# EasyEDA Pro project ProProject_STM32G030F6P6开发板V1.1_2023-09-02.epro

# Schematic ScV1.1
Create Date: 2023-07-08; Page Name: P1; Project Name: STM32G030F6P6开发板V1.1; Schematic Name: ScV1.1; Update Date: 2023-07-08; Company: 嘉立创EDA; Page Size: A5; Version: V1.0
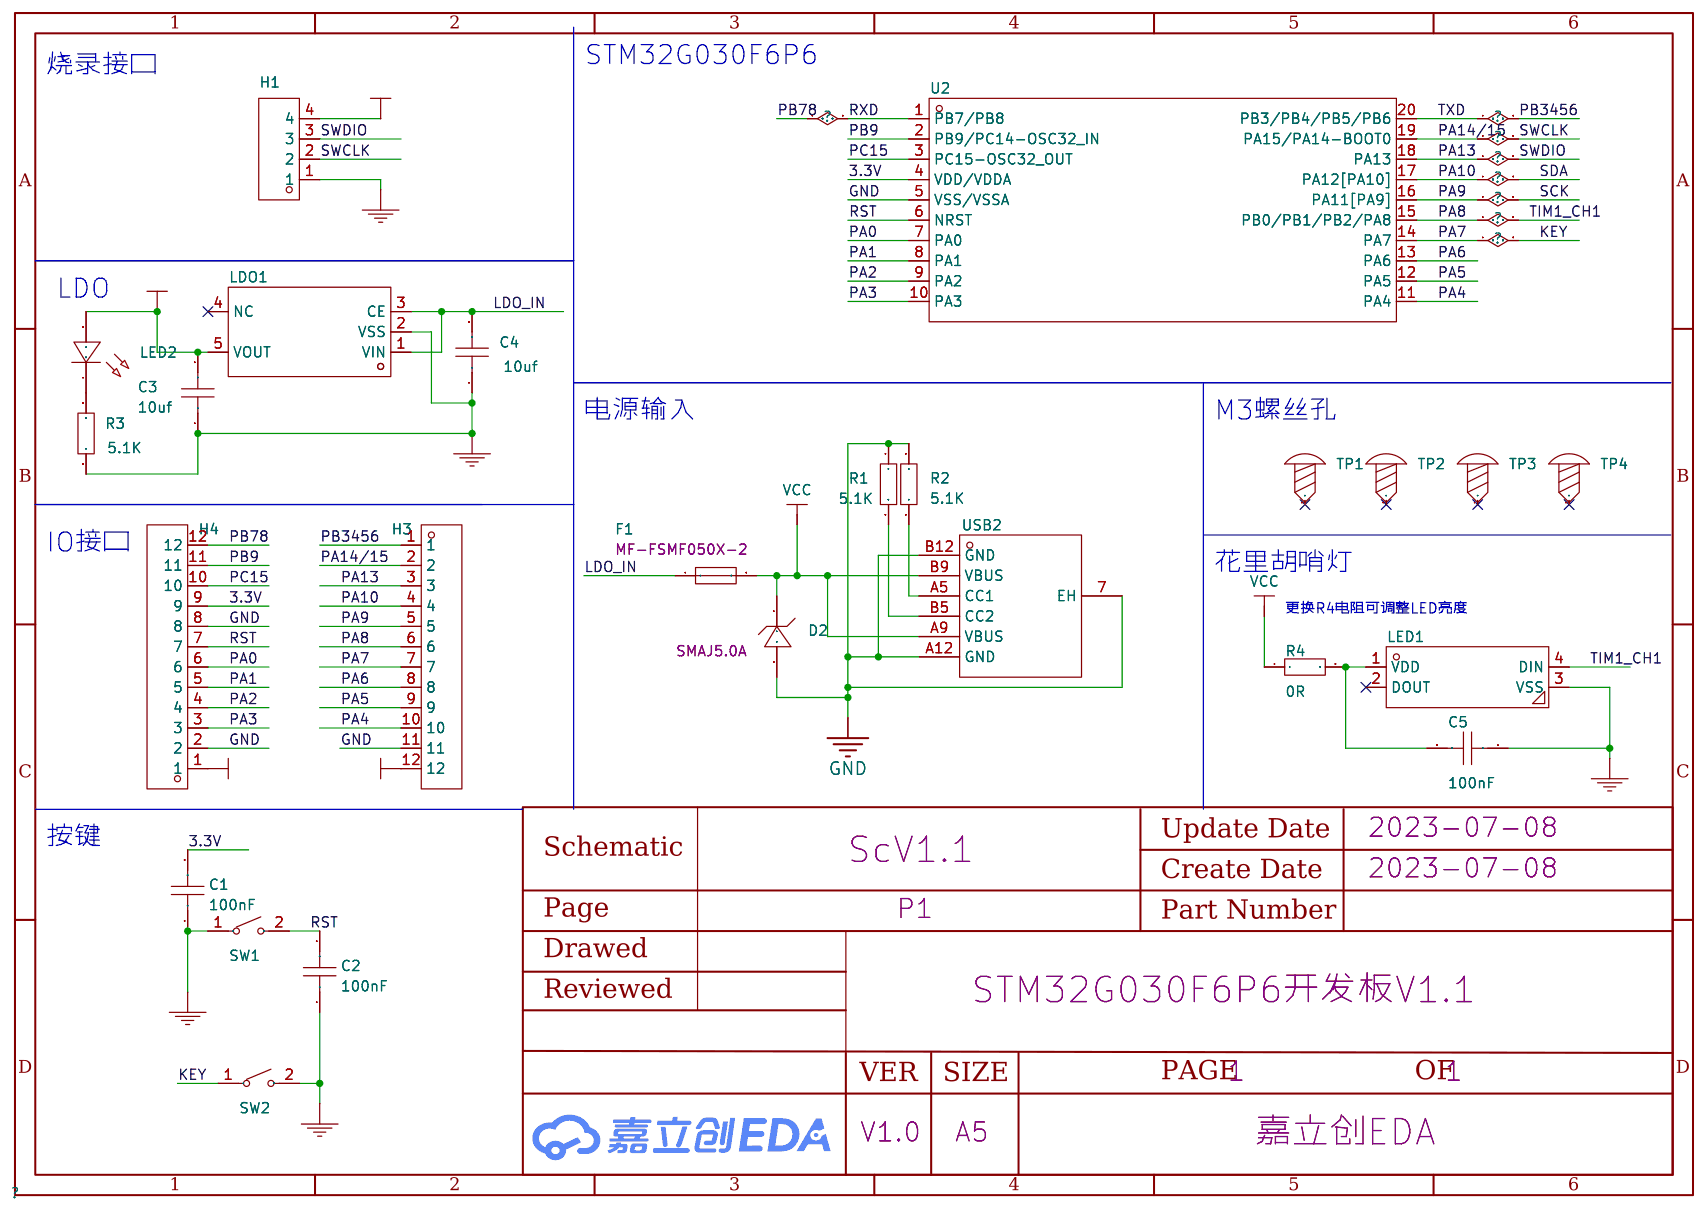
[diagram p0: schematic sheet]

## Parts
C1  100nF  [C0603]
C2  100nF  [C0603]
C3  10uf  [C0603]
C4  10uf  [C0603]
C5  100nF  [C0603]
D2  SMAJ5.0A  [SMA_L4.4-W2.6-LS5.0-RD]
F1  MF-FSMF050X-2  [F0603]
H1  -  [HDR-TH_4P-P2.54-V-F]
H3  -  [HDR-TH_12P-P2.54-V-M]
H4  -  [HDR-TH_12P-P2.54-V-M]
LDO1  -  [SOT-23-5_L3.0-W1.7-P0.95-LS2.8-BR]
LED1  WS2812B-B/W  [LED-SMD_4P-L5.0-W5.0-BL_TC5050RGB]
LED2  -  [LED_0603]
R1  5.1K  [R0603]
R2  5.1K  [R0603]
R3  5.1K  [R0603]
R4  0R  [R0603]
SW1  TS-1088R-02026  [SW-SMD_L3.9-W3.0-P4.45]
SW2  TS-1088R-02026  [SW-SMD_L3.9-W3.0-P4.45]
TP1  -  [M3螺丝]
TP2  -  [M3螺丝]
TP3  -  [M3螺丝]
TP4  -  [M3螺丝]
U2  -  [TSSOP-20_L6.5-W4.4-P0.65-LS6.4-BL]
USB2  -  [TYPE-C-SMD_TYPE-C-6P]

## Library data of the parts
C1-C5 = CAP_0603: Supplier Footprint: 0603
D2 = SMAJ5.0A_C113952: 极性:单向;反向截止电压(Vrwm):5V;击穿电压:6.4V;反向漏电流(Ir):800uA;峰值脉冲电流(Ipp)@10/1000s:43.5A;最大钳位电压:9.2V;; LCSC Part Name: 单向 Vrwm:5V; Supplier Part: C113952; Manufacturer: MDD; Supplier Footprint: SMA(DO-214AC); JLCPCB Part Class: Extended Part; Datasheet: https://atta.szlcsc.com/upload/public/pdf/source/20230314/4319D8044EE29783A53F6AC60595AA71.pdf; Supplier: LCSC; Polarity: 单向; Reverse Stand-Off Voltage (Vrwm): 5V; Breakdown Voltage: 6.4V; Reverse Leakage Current (Ir): 800uA; Peak Pulse Current (Ipp)@10/1000μs: 43.5A; Maximum Clamping Voltage: 9.2V
F1 = MF-FSMF050X-2: 最大电压:6V;最大电流:40A;保持电流:500mA;跳闸电流:1A;初始态阻值(最小值):800mΩ;跳断后阻值(最大值):100mΩ;最大动作时间:100ms;工作温度:-40℃~+85℃;; LCSC Part Name: 6V 500mA; Supplier Part: C210357; Manufacturer: BOURNS; Supplier Footprint: 0603; JLCPCB Part Class: Extended Part; Datasheet: https://atta.szlcsc.com/upload/public/pdf/source/20180524/C210357_26D2BEEFC098B5962B9D8AEB60E1F9FC.pdf; Supplier: LCSC; Operating Voltage (Max): 6V; Current Rating (Max): 40A; Hold Current: 500mA; Trip Current: 1A; Resistance - Initial (Ri) (Min): 800mΩ; Resistance - Post Trip (R1) (Max): 100mΩ; Maximum Time to Trip: 100ms; Operating Temperature: -40℃~+85℃
H1 = HDR-F_2.54_1x4P: Supplier Part: C2718488; Supplier Footprint: 插件
H3 H4 = HDR-M_2.54_1x12P: 间距:2.54mm;总PIN位数:12;排数:1;插针结构:1x12P;行距:-;安装类型:直插;圆针/方针:方针;额定电流:3A;额定电压:250V;配合针长度:6mm;塑高:2.5mm;端接针长度:3mm;触头材质:-;工作温度范围:-40℃~+105℃;颜色:黑色;; Supplier Part: C2840012; Supplier Footprint: 插件
LDO1 = ME6211C33M5G-N: 输出类型:固定;输出极性:正;输出通道数:1;最大输入电压:6V;输出电压:3.3V;压差:260mV@(200mA);输出电流:500mA;电源纹波抑制比(PRSS):70dB@(1kHz),62dB@(10kHz);; LCSC Part Name: Vin=6V Vout=3.3V 500mA 70dB@(1kHz),62dB@(10kHz); Supplier Part: C82942; Manufacturer: MICRONE(南京微盟); Supplier Footprint: SOT-23-5; JLCPCB Part Class: Extended Part; Datasheet: https://atta.szlcsc.com/upload/public/pdf/source/20170918/C82942_1505727073070976520.pdf; Supplier: LCSC; Output Type: 固定; Output Polarity: 正; Number of Outputs: 1; Maximum Input Voltage: 6V; Output Voltage: 3.3V; Dropout Voltage: 260mV@(200mA); Output Current: 500mA; Power Supply Rejection Ratio (PRSS): 70dB@(1kHz),62dB@(10kHz)
LED1 = WS2812B-B/W: 发光颜色:RGB三色;; LCSC Part Name: RGB三色 （注意防潮，请查阅规格书中对应具体内容）; Supplier Part: C114586; Manufacturer: worldsemi; Supplier Footprint: SMD5050; JLCPCB Part Class: Extended Part; Datasheet: https://atta.szlcsc.com/upload/public/pdf/source/20200615/C114586_26EB6813EC9F2A3F6C7FBB2AD75DE01F.pdf; Supplier: LCSC; Emitted Color: RGB三色
LED2 = LED_0603-G: Supplier Footprint: 0603
R1-R4 = Res_0603: Supplier Footprint: 0603
SW1 SW2 = TS-1088R-02026: 触点电流:50mA;额定电压(DC):12V;电路结构:单刀单掷;安装方式:立贴;带灯:-;机械寿命:-;; LCSC Part Name: 3.9*2.93*2mm 立贴 轻触开关; Supplier Part: C455280; Manufacturer: XUNPU(讯普); Supplier Footprint: SMD,3x4mm; JLCPCB Part Class: Extended Part; Datasheet: https://atta.szlcsc.com/upload/public/pdf/source/20191118/C455280_718CC4284DAF75EEB0AC8229AE7E40C5.pdf; Supplier: LCSC; Contact Current: 50mA; Voltage Rating (DC): 12V; Circuit: 单刀单掷; Mounting Style: 立贴; Actuator Style: 圆形按钮; Switch Length: 3.9mm; Switch Width: 2.93mm; Switch Height: 2mm
TP1-TP4 = M3螺丝: Supplier Footprint: 插件
U2 = STM32G030F6P6: CPU位数:-;ROM类型:-;CPU内核:-;主频（MAX):-;工作电压:-;; Supplier Part: C724040; Manufacturer: ST(意法半导体); Supplier Footprint: TSSOP-20; JLCPCB Part Class: Extended Part; Datasheet: https://atta.szlcsc.com/upload/public/pdf/source/20200511/C529329_A1CB615556C746C4EA827FCAD1461480.pdf; Supplier: LCSC
USB2 = TYPE-C 6P: 连接器类型:Type-C;标准:-;公母:母座;触点数量:6;端口数量:1;安装方式:卧贴;额定电流 - 电源:-;工作温度范围:-40~+85;; LCSC Part Name: Type-C 母头 6pin简易款四脚端子SMT+DIP 停产; Supplier Part: C456012; Manufacturer: SHOU HAN(首韩); Supplier Footprint: SMD; JLCPCB Part Class: Extended Part; Datasheet: https://atta.szlcsc.com/upload/public/pdf/source/20201203/C456012_B13F72044DF846EDBE9BDD0D1D3CD166.pdf; Supplier: LCSC; Connector Type: Type-C; Gender: 母座; Number of Contacts: 6; Number of Ports: 1; Mounting Style: 卧贴; Operating Temperature Range: -40~+85

## Nets
3.3V: C1.2 C3.2 H1.4 H4.9 LDO1.5(VOUT) LED2.2(A) U2.4(VDD/VDDA)
GND: C1.1 C2.1 C3.1 C4.1 C5.1 D2.2 H1.1 H3.11 H4.2 H4.8 LDO1.2(VSS) LED1.3(VSS) R1.1 R2.1 R3.1 SW1.1 SW2.2 U2.5(VSS/VSSA) USB2.7(EH) USB2.A12(GND) USB2.B12(GND)
VCC: D2.1 F1.2 H3.12 H4.1 R4.1 USB2.A9(VBUS) USB2.B9(VBUS)
KEY: H3.7 SW2.1 U2.14(PA7)
LDO_IN: C4.2 F1.1 LDO1.1(VIN) LDO1.3(CE)
PA0: H4.6 U2.7(PA0)
PA1: H4.5 U2.8(PA1)
PA2: H4.4 U2.9(PA2)
PA3: H4.3 U2.10(PA3)
PA4: H3.10 U2.11(PA4)
PA5: H3.9 U2.12(PA5)
PA6: H3.8 U2.13(PA6)
PA8: H3.6 LED1.4(DIN) U2.15(PB0/PB1/PB2/PA8)
PA9: H3.5 U2.16(PA11[PA9])
PA10: H3.4 U2.17(PA12[PA10])
PA13: H1.3 H3.3 U2.18(PA13)
PA14/15: H1.2 H3.2 U2.19(PA15/PA14-BOOT0)
PB9: H4.11 U2.2(PB9/PC14-OSC32_IN)
PB78: H4.12 U2.1(PB7/PB8)
PB3456: H3.1 U2.20(PB3/PB4/PB5/PB6)
PC15: H4.10 U2.3(PC15-OSC32_OUT)
RST: C2.2 H4.7 SW1.2 U2.6(NRST)
$1N33946: R2.2 USB2.A5(CC1)
$1N33995: R1.2 USB2.B5(CC2)
$1N39689: LED2.1(C) R3.2
$1N41704: C5.2 LED1.1(VDD) R4.2

Not connected (* = marked no-connect by the designer): LDO1 4(NC)*; LED1 2(DOUT)*; TP1 1*; TP2 1*; TP3 1*; TP4 1*

## Notes on the sheet
- 烧录接口
- STM32G030F6P6
- LDO
- 电源输入
- M3螺丝孔
- IO接口
- 花里胡哨灯
- 更换R4电阻可调整LED亮度
- 按键

# Board PCBV1.1
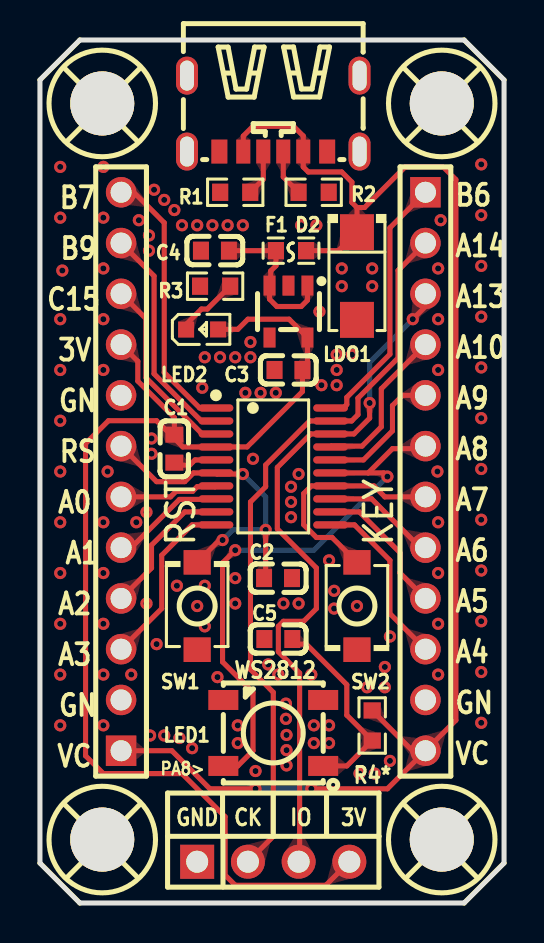
[diagram p1: board, top side]
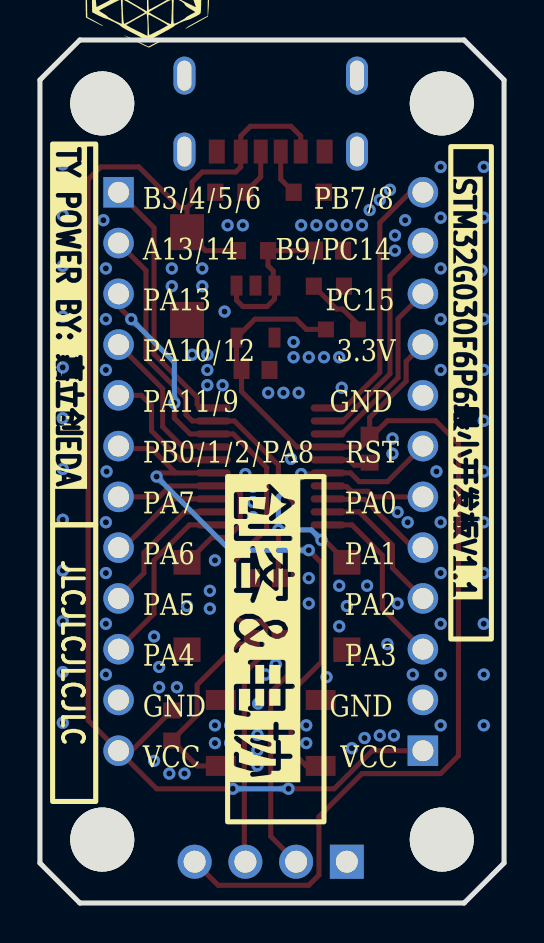
[diagram p2: board, bottom side, seen from below]

Outline 23.24 x 43.18 mm; copper layers: Top Layer, Bottom Layer. Coordinates in mm from the lower left corner of the outline.
Outline path: 0,41.18 0,2 2,0 21.24,0 23.24,2 23.24,41.18 21.24,43.18 2,43.18 0,41.18
Stack: Top Layer 0.035mm / Dielectric1 1.51mm FR4 er 4.5 / Bottom Layer 0.035mm

## Design rules (mm)
spacing safeClearance (default): track to track 0.152, other pairs 0.152 to 0.3
spacing IO_Clearance: track to track 0.08, other pairs 0.152 to 0.3
track width trackWidth (default): min 0.127, default 0.254, max 2.54
differential pair differentialPair (default): width min 0.127, default 0.254, max 2.54; gap min 0.152, default 0.152
via viaSize (default): diameter min 0.25, default 0.3, max 5; hole min 0.15, default 0.15, max 3

## Placement (name value [footprint] x y rotation side)
C1  100nF  [C0603]  6.73 22.73 90 top
C2  100nF  [C0603]  11.92 16.26 180 top
C3  10uf  [C0603]  12.45 26.67 0 top
C4  10uf  [C0603]  8.76 32.64 0 top
C5  100nF  [C0603]  11.94 13.21 0 top
D2  SMAJ5.0A  [SMA_L4.4-W2.6-LS5.0-RD]  15.88 31.37 270 top
F1  MF-FSMF050X-2  [F0603]  12.57 32.64 0 top
H1  2.54-1*4P母  [HDR-TH_4P-P2.54-V-F]  11.68 2.07 0 top
H3  KH-2PH180-1X12P-L8.7  [HDR-TH_12P-P2.54-V-M]  19.3 21.59 270 top
H4  KH-2PH180-1X12P-L8.7  [HDR-TH_12P-P2.54-V-M]  4.06 21.59 90 top
LDO1  ME6211C33M5G-N  [SOT-23-5_L3.0-W1.7-P0.95-LS2.8-BR]  12.45 29.59 90 top
LED1  WS2812B-B/W  [LED-SMD_4P-L5.0-W5.0-BL_TC5050RGB]  11.68 8.51 180 top
LED2  -  [LED_0603]  8.17 28.7 0 top
R1  5.1K  [R0603]  9.78 35.56 0 top
R2  5.1K  [R0603]  13.71 35.56 180 top
R3  5.1K  [R0603]  8.77 30.86 0 top
R4  0R  [R0603]  16.64 8.88 270 top
SW1  TS-1088R-02026  [SW-SMD_L3.9-W3.0-P4.45]  7.87 14.86 90 top
SW2  TS-1088R-02026  [SW-SMD_L3.9-W3.0-P4.45]  15.88 14.86 270 top
TP1  -  [M3螺丝]  3.18 3.11 0 top
TP2  -  [M3螺丝]  20.18 3.11 0 top
TP3  -  [M3螺丝]  3.18 39.94 0 top
TP4  -  [M3螺丝]  20.18 39.94 0 top
U2  -  [TSSOP-20_L6.5-W4.4-P0.65-LS6.4-BL]  11.68 21.84 270 top
USB2  -  [TYPE-C-SMD_TYPE-C-6P]  11.68 39.5 180 top

## Footprints (pads in the part's own frame, mm; a bottom-side part is the same pattern mirrored in y, then rotated)
C0603
  rect 0.8x0.9 smd: 1(-0.7,0) 2(0.7,0)
F0603
  rect 0.806x0.864 smd: 1(-0.753,0) 2(0.753,0)
HDR-TH_4P-P2.54-V-F
  rect 1.7x1.7 hole 1.1: 1(-3.81,0)
  round 1.7 hole 1.1: 2(-1.27,0) 3(1.27,0) 4(3.81,0)
HDR-TH_12P-P2.54-V-M
  rect 1.524x1.524 hole 1.05: 1(-13.97,0)
  round 1.524 hole 1.05: 2(-11.43,0) 3(-8.89,0) 4(-6.35,0) 5(-3.81,0) 6(-1.27,0) 7(1.27,0) 8(3.81,0) 9(6.35,0) 10(8.89,0) 11(11.43,0) 12(13.97,0)
LED-SMD_4P-L5.0-W5.0-BL_TC5050RGB
  rect 1.5x1 smd: 1(-2.5,1.65) 2(-2.5,-1.65) 3(2.5,-1.65) 4(2.5,1.65)
LED_0603
  rect 0.8x0.8 smd: 1(-0.851,-0.01) 2(0.75,-0.005)
M3螺丝
  round 3.2 hole 3.2: 1(-0.064,0.064)
R0603
  rect 0.806x0.864 smd: 1(-0.753,0) 2(0.753,0)
SMA_L4.4-W2.6-LS5.0-RD
  rect 1.8x1.7 smd: 1(-2.192,0) 2(2.192,0)
SOT-23-5_L3.0-W1.7-P0.95-LS2.8-BR
  rect 1x0.6 smd: 1(1.3,-0.95) 2(1.3,0) 3(1.3,0.95) 4(-1.3,0.95) 5(-1.3,-0.95)
SW-SMD_L3.9-W3.0-P4.45
  rect 1.23x1.36 smd: 1(-2.185,0) 2(2.185,0)
TSSOP-20_L6.5-W4.4-P0.65-LS6.4-BL
  oval 0.364x1.742 smd: 1(-2.925,-2.871) 2(-2.275,-2.871) 3(-1.625,-2.871) 4(-0.975,-2.871) 5(-0.325,-2.871) 6(0.325,-2.871) 7(0.975,-2.871) 8(1.625,-2.871) 9(2.275,-2.871) 10(2.925,-2.871) 11(2.925,2.871) 12(2.275,2.871) 13(1.625,2.871) 14(0.975,2.871) 15(0.325,2.871) 16(-0.325,2.871) 17(-0.975,2.871) 18(-1.625,2.871) 19(-2.275,2.871) 20(-2.925,2.871)
TYPE-C-SMD_TYPE-C-6P
  oval 1.1x1.9 hole 0.701x1.501: 7(-4.321,1.9) 7(-4.321,-1.9) 7(4.321,1.9) 7(4.321,-1.9)
  rect 0.701x1.199 smd: A5(-0.5,1.9) A9(1.501,1.9) B5(0.5,1.9) B9(-1.501,1.9)
  rect 0.8x1.199 smd: A12(2.7,1.9) B12(-2.7,1.9)

## Nets
As in the schematic.

Pads without a net: LDO1 4; LED1 2; TP1 1; TP2 1; TP3 1; TP4 1

## Via types
v1: diameter 0.61, hole 0.305, Top Layer to Bottom Layer, 136 vias

## Routing (per net, layer and track width the routed paths; a pad name or vN(x,y) marks a point on that pad's centre or on a via; arc(x,y) is an arc through that point)
3.3V: length 60.1
  Top Layer w0.254: 6.48,23.5 5.84,24.13 3.43,24.13 2.29,22.99 2.29,7.37 3.18,6.48 7.11,6.48 9.27,4.32 9.27,1.4 9.78,0.89 14.32,0.89 H1.4 ; 6.48,23.5 7.15,22.82 U2.4 10.37,22.82 13.15,25.59 C3.2 13.4,26.92 13.4,28.29 12.48,29.21 10.41,29.21 9.91,28.7 9.27,28.7 ; 6.48,23.5 6.73,23.5 6.73,24.28 4.9,26.11 4.9,27.1 H4.9
GND: length 2.4
  Top Layer w0.254: U2.5 7.76,22.17 7.5,21.91 6.48,21.91
  vias: v1(1.02,36.83) v1(1.02,34.29) v1(1.02,29.21) v1(1.02,26.67) v1(1.02,24.13) v1(1.02,21.59) v1(1.02,19.05) v1(1.02,16.51) v1(1.02,13.97) v1(1.02,11.43) v1(1.02,8.89) v1(1.12,31.64) v1(3.18,36.83) v1(3.18,34.29) v1(3.18,31.75) v1(3.18,29.21) v1(3.18,26.67) v1(3.18,19.05) v1(3.18,16.51) v1(3.18,13.97) v1(3.18,11.43) v1(3.18,8.89) v1(3.39,21.59) v1(4.57,11.43) v1(4.83,19.05) v1(4.95,34.16) v1(5.33,19.56) v1(5.33,14.99) v1(5.46,33.4) v1(5.46,32.64) v1(5.52,8.38) v1(5.59,23.24) v1(5.59,22.48) v1(5.72,35.69) v1(5.84,12.95) v1(6.22,35.18) v1(6.22,8.38) v1(6.73,34.67) v1(6.86,15.88) v1(6.98,8.26) v1(7.11,33.91) v1(7.62,7.75) v1(7.87,33.91) v1(7.87,14.86) v1(8.13,25.78) v1(8.25,27.31) v1(8.25,15.88) v1(8.25,13.84) v1(8.64,33.91) v1(8.89,11.3) v1(9.02,27.31) v1(9.4,33.91) v1(9.78,27.31) v1(9.78,16.26) v1(9.78,14.99) v1(9.91,8.89) v1(9.91,8) v1(10.16,33.91) v1(10.29,25.53) v1(10.54,28.07) v1(10.54,27.31) v1(10.67,22.23) v1(10.79,6.6) v1(11.05,25.53) v1(11.43,11.94) v1(11.81,25.53) v1(11.94,11.43) v1(12.19,14.99) v1(12.32,9.98) v1(12.32,9.21) v1(12.35,8.41) v1(12.35,7.65) v1(12.35,6.89) v1(12.57,20.83) v1(12.57,20.07) v1(12.57,19.3) v1(12.95,21.46) v1(12.95,14.99) v1(13.08,33.91) v1(13.59,11.43) v1(13.72,8.89) v1(13.72,8) v1(13.84,33.91) v1(14,29.59) v1(14.1,25.91) v1(14.48,17.15) v1(14.48,8.89) v1(14.48,8) v1(14.73,15.62) v1(14.73,14.73) v1(14.86,27.43) v1(14.86,26.67) v1(14.86,25.91) v1(15.11,31.75) v1(15.11,30.86) v1(15.62,27.43) v1(15.88,14.86) v1(16,6.48) v1(16.38,10.8) v1(16.64,31.75) v1(16.64,30.86) v1(16.76,6.48) v1(17.27,11.81) v1(17.27,10.8) v1(17.53,13.34) v1(17.53,7.11) v1(19.9,21.59) v1(19.94,31.75) v1(19.94,29.21) v1(19.94,26.67) v1(19.94,19.05) v1(19.94,16.51) v1(19.94,13.97) v1(19.94,11.43) v1(20.07,34.16) v1(22.1,36.96) v1(22.1,34.42) v1(22.1,31.88) v1(22.1,29.34) v1(22.1,26.8) v1(22.1,24.26) v1(22.1,21.72) v1(22.1,19.18) v1(22.1,16.64) v1(22.1,14.1) v1(22.1,11.56) v1(22.1,9.02)
VCC: length 69.6
  Top Layer w0.254: H3.12 18.65,7.62 R4.1 ; H3.12 20.83,9.14 20.83,36.2 20.19,36.83 18.29,36.83 16.26,34.8 15.88,34.8 ; H3.12 17.4,5.72 v1(13.59,5.72) ; H4.1 6.6,7.62 8.51,5.72 v1(10.79,5.72) ; 15.88,34.8 15.62,35.05 15.62,36.07 15.11,36.58 13.44,36.58 13.19,36.83 13.19,38.38 12.7,38.86 10.67,38.86 10.18,38.37 10.18,37.6 ; 15.88,34.8 15.88,33.57 14.94,32.64 F1.2
  Bottom Layer w0.254: v1(13.59,5.72) v1(10.79,5.72)
KEY: length 11.5
  Top Layer w0.254: SW2.1 14.63,18.29 13.84,18.29 13.21,18.92 13.21,20.49 13.59,20.87 U2.14 16.72,20.87 17.27,20.32 H3.7
LDO_IN: length 7.8
  Top Layer w0.254: C4.2 F1.1 11.82,31.89 11.56,31.62 11.56,30.95 LDO1.3 11.5,30.21 11.86,29.84 13.08,29.84 13.4,30.16 LDO1.1
PA0: length 5
  Top Layer w0.254: U2.7 8.77,20.83 7.87,20.83 7.65,20.6 6.82,20.6 6.54,20.32 H4.6
PA1: length 5.8
  Top Layer w0.254: H4.5 4.57,17.78 6.98,20.19 8.79,20.19 U2.8
PA2: length 7.2
  Top Layer w0.254: H4.4 5.59,16.76 5.59,17.91 7.25,19.57 U2.9
PA3: length 8.9
  Top Layer w0.254: 8.81,18.92 7.62,18.92 6.1,17.4 6.1,14.73 H4.3
PA4: length 8.9
  Top Layer w0.254: 14.56,18.92 15.75,18.92 17.53,17.15 17.53,14.48 H3.10
PA5: length 7.1
  Top Layer w0.254: H3.9 18.03,16.51 18.03,17.53 15.99,19.57 U2.12
PA6: length 5.8
  Top Layer w0.254: U2.13 16.61,20.22 19.05,17.78 H3.8
PA8: length 28.2
  Top Layer w0.254: v1(9.78,17.65) 9.14,17.02 9.14,12.06 10.67,10.54 10.67,7.62 9.91,6.86 LED1.4 ; 16.44,21.52 17.22,21.52 v1(17.4,21.34) ; 16.44,21.52 U2.15 ; 16.44,21.52 17.65,22.73 19.18,22.73 H3.6
  Bottom Layer w0.254: v1(9.78,17.65) 13.72,17.65 v1(17.4,21.34)
PA9: length 6.8
  Top Layer w0.254: U2.16 16.2,22.17 17.65,23.62 17.65,24.89 18.16,25.4 H3.5
PA10: length 8
  Top Layer w0.254: U2.17 14.6,22.86 16.13,22.86 17.09,23.83 17.09,25.73 H3.4
PA13: length 35.4
  Top Layer w0.254: v1(18.67,29.21) 19.3,29.84 H3.3 ; H1.3 13,2.12 13,11.51 11.94,12.57 11.94,13.84 12.19,14.1 13.21,14.1 13.84,14.73 13.84,16.76 11.89,18.72 11.89,21.79 13.56,23.47 U2.18 15.72,23.47 16.51,24.26 v1(16.51,25.02)
  Bottom Layer w0.254: v1(16.51,25.02) 16.51,27.05 v1(18.67,29.21)
PA14/15: length 36.8
  Top Layer w0.254: H3.2 17.93,31.65 17.93,27.27 15.93,25.26 15.93,24.43 15.61,24.12 13.51,24.12 11.3,21.92 11.3,20.83 10.54,20.07 10.54,11.68 11.68,10.54 11.68,3.34 H1.2
PB9: length 11.3
  Top Layer w0.254: 8.81,24.12 8.07,24.12 5.72,26.48 5.72,31.37 H4.11
PB78: length 13.6
  Top Layer w0.254: H4.12 4.7,35.56 6.22,34.04 6.22,26.54 8,24.77 U2.1
PB3456: length 13.1
  Top Layer w0.254: H3.1 17.53,33.78 17.53,27.46 15.37,25.3 15.37,24.94 15.19,24.77 U2.20
PC15: length 9.4
  Top Layer w0.254: U2.3 8.12,23.47 5.31,26.28 5.31,29.24 H4.10
RST: length 16.8
  Top Layer w0.254: H4.7 5.84,21.08 7.25,21.08 7.69,21.52 U2.6 8.87,21.46 v1(10.16,21.46) ; v1(11.3,18.67) 11.3,16.32 11.37,16.26 ; SW1.2 8.99,18.16 v1(9.14,18.16)
  Bottom Layer w0.254: v1(9.14,18.16) 9.65,18.67 v1(11.3,18.67) 11.3,20.32 v1(10.16,21.46)
$1N33946: length 2.4
  Top Layer w0.254: 12.18,37.6 12.18,36.33 R2.2
$1N33995: length 2.3
  Top Layer w0.254: 11.18,37.6 11.18,36.21 R1.2
$1N39689: length 3.3
  Top Layer w0.254: R3.2 8.38,29.72 8.09,29.72 7.07,28.7
$1N41704: length 10
  Top Layer w0.254: C5.2 12.89,12.95 13.34,12.95 15.37,10.92 15.37,9.4 R4.2 15.37,6.86 LED1.1

## Copper pours and planes (outline as drawn; the poured copper is in the pictures)
GND on Top Layer: -8.64,44.07 28.96,44.07 28.96,-1.91 -8.64,-1.91
GND on Bottom Layer: -0.38,44.32 24.76,44.32 24.76,-2.41 -0.38,-2.41

Small or netless copper shapes (teardrops, artwork), in the pictures only: 92 on Top Layer, 10 on Bottom Layer

## Text on the board
Bottom Silkscreen Layer: JLCJLCJLCJLC | RST | PA0 | PA1 | PA2 | PA3 | VCC | 3.3V | GND | PC15 | PB7/8 | B9/PC14 | B3/4/5/6 | A13/14 | PA13 | PA10/12 | PA11/9 | PB0/1/2/PA8 | PA7 | PA6 | PA5 | PA4 | STM32G030F6P6最小开发板V1.1 | TY POWER BY: 嘉立创EDA | 创客&电协
Top Silkscreen Layer: PA8> | WS2812 | GND | CK | IO | 3V | R4* | C15 | VC | A0 | A2 | A3 | GN | B7 | RS | B9 | A1 | B6 | A14 | A13 | A10 | A9 | A8 | A7 | A6 | A5 | A4 | RST | KEY
